# EAGLE design ECG-BioZ-Holter (EAGLE 6.5.0)

## Sheet 1 of 4
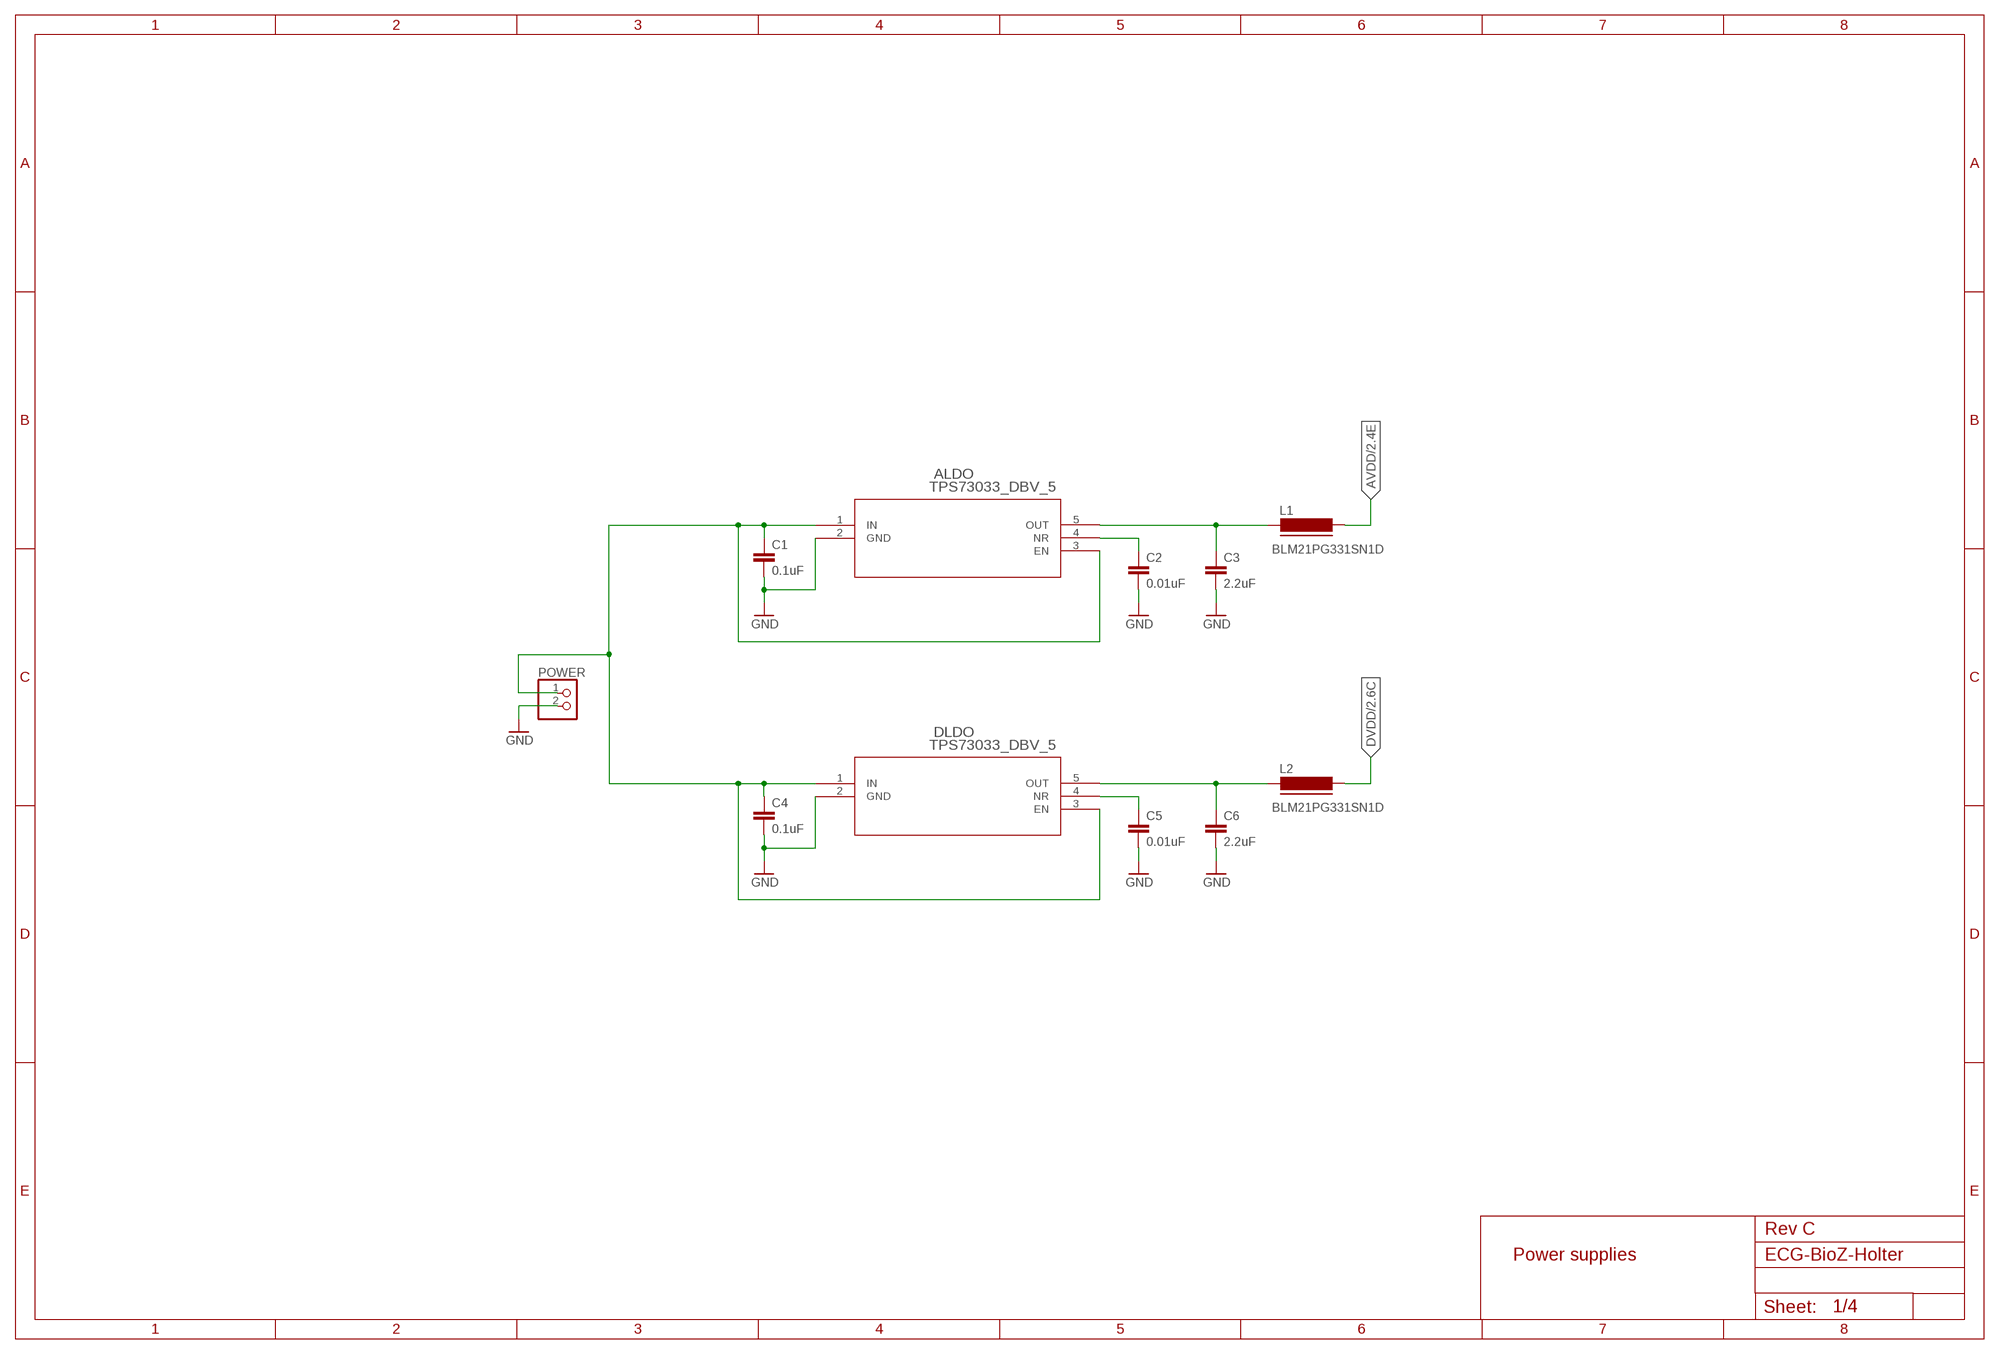
[diagram p0: schematic, sheet 1]

### Parts
ALDO  TPS73033_DBV_5  [DBV5]
C1  0.1uF  C-EUC0805  [C0805]
C2  0.01uF  C-EUC0805  [C0805]
C3  2.2uF  C-EUC0805  [C0805]
C4  0.1uF  C-EUC0805  [C0805]
C5  0.01uF  C-EUC0805  [C0805]
C6  2.2uF  C-EUC0805  [C0805]
DLDO  TPS73033_DBV_5  [DBV5]
L1  BLM21PG331SN1D  FERRITE-0805  [FB805]
L2  BLM21PG331SN1D  FERRITE-0805  [FB805]
POWER  PINHD-1X2  [1X02]

### Nets
AVDD: L1.2 ; also sheet 2
DVDD: L2.2 ; also sheet 2,3,4
GND: ALDO.2(GND) C1.2 C2.2 C3.2 C4.2 C5.2 C6.2 DLDO.2(GND) POWER.2 ; also sheet 2,3,4
N$2: ALDO.1(IN) ALDO.3(EN) C1.1 C4.1 DLDO.1(IN) DLDO.3(EN) POWER.1
N$5: C5.1 DLDO.4(NR)
N$6: ALDO.4(NR) C2.1
N$7: ALDO.5(OUT) C3.1 L1.1
N$8: C6.1 DLDO.5(OUT) L2.1

### Notes on the sheet
- Rev C
- Power supplies

## Sheet 2 of 4
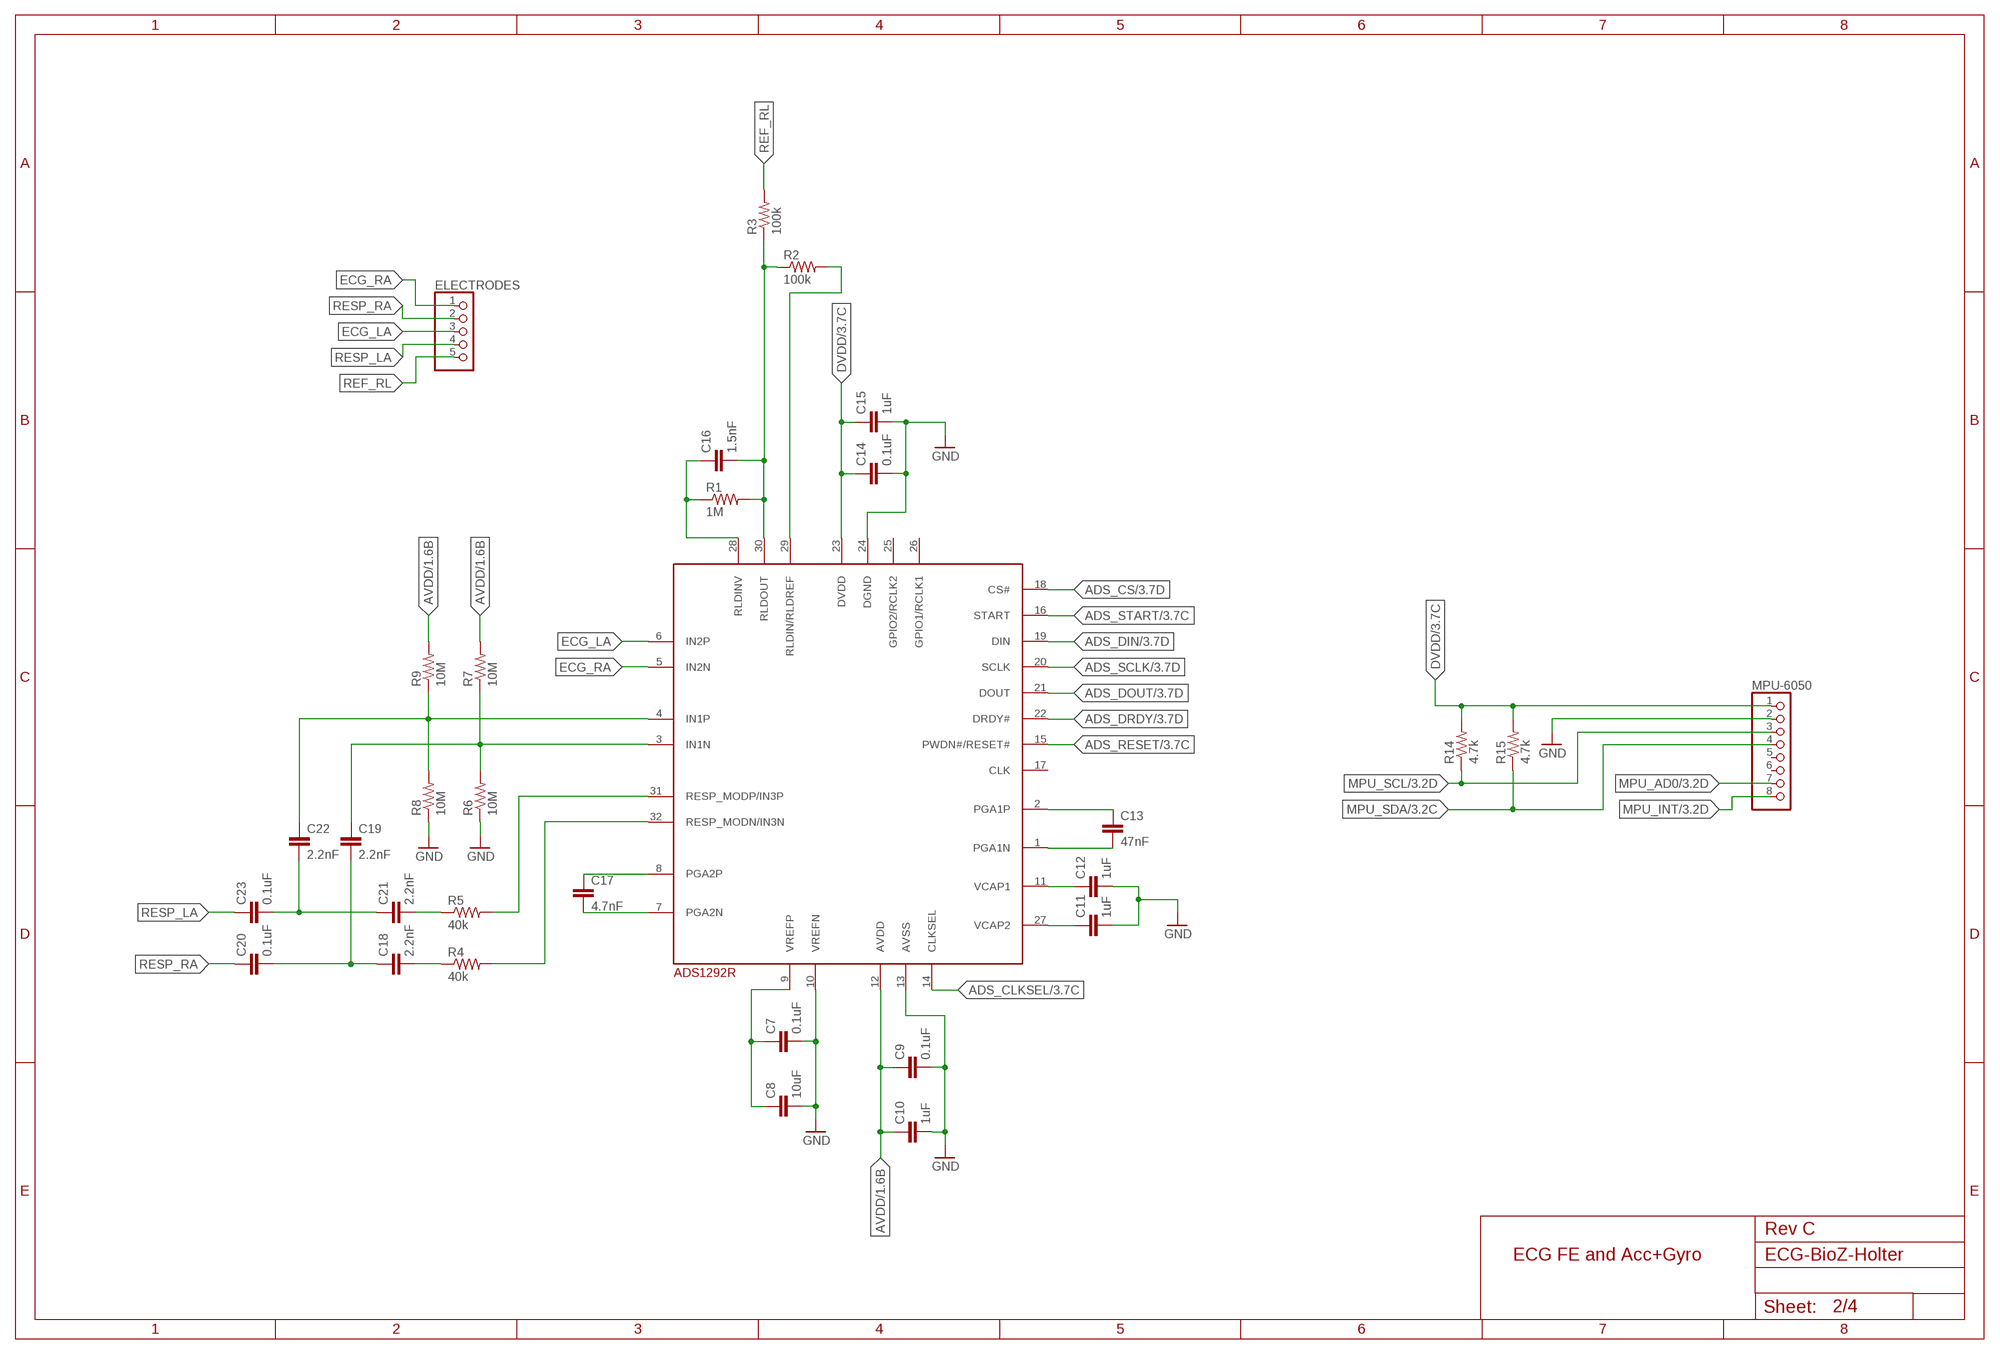
[diagram p1: schematic, sheet 2]

### Parts
ADS1292R  ADS1292R  [TQFP-32]
C7  0.1uF  C-EUC0805  [C0805]
C8  10uF  C-EUC0805  [C0805]
C9  0.1uF  C-EUC0805  [C0805]
C10  1uF  C-EUC0805  [C0805]
C11  1uF  C-EUC0805  [C0805]
C12  1uF  C-EUC0805  [C0805]
C13  47nF  C-EUC0805  [C0805]
C14  0.1uF  C-EUC0805  [C0805]
C15  1uF  C-EUC0805  [C0805]
C16  1.5nF  C-EUC0805  [C0805]
C17  4.7nF  C-EUC0805  [C0805]
C18  2.2nF  C-EUC0805  [C0805]
C19  2.2nF  C-EUC0805  [C0805]
C20  0.1uF  C-EUC0805  [C0805]
C21  2.2nF  C-EUC0805  [C0805]
C22  2.2nF  C-EUC0805  [C0805]
C23  0.1uF  C-EUC0805  [C0805]
ELECTRODES  PINHD-1X5  [1X05]
MPU  MPU-6050  PINHD-1X8  [1X08]
R1  1M  R-US_R0805  [R0805]
R2  100k  R-US_R0805  [R0805]
R3  100k  R-US_R0805  [R0805]
R4  40k  R-US_R0805  [R0805]
R5  40k  R-US_R0805  [R0805]
R6  10M  R-US_R0805  [R0805]
R7  10M  R-US_R0805  [R0805]
R8  10M  R-US_R0805  [R0805]
R9  10M  R-US_R0805  [R0805]
R14  4.7k  R-US_R0805  [R0805]
R15  4.7k  R-US_R0805  [R0805]

### Nets
ADS_CLKSEL: ADS1292R.14(CLKSEL) ; also sheet 3
ADS_CS: ADS1292R.18(CS#) ; also sheet 3
ADS_DIN: ADS1292R.19(DIN) ; also sheet 3
ADS_DOUT: ADS1292R.21(DOUT) ; also sheet 3
ADS_DRDY: ADS1292R.22(DRDY#) ; also sheet 3
ADS_RESET: ADS1292R.15(PWDN#/RESET#) ; also sheet 3
ADS_SCLK: ADS1292R.20(SCLK) ; also sheet 3
ADS_START: ADS1292R.16(START) ; also sheet 3
AVDD: ADS1292R.12(AVDD) C9.1 C10.1 R7.2 R9.2 ; also sheet 1
DVDD: ADS1292R.23(DVDD) C14.1 C15.1 MPU.1 R14.2 R15.2 ; also sheet 1,3,4
ECG_LA: ADS1292R.6(IN2P) ELECTRODES.3
ECG_RA: ADS1292R.5(IN2N) ELECTRODES.1
GND: ADS1292R.10(VREFN) ADS1292R.13(AVSS) ADS1292R.24(DGND) C7.2 C8.2 C9.2 C10.2 C11.2 C12.2 C14.2 C15.2 MPU.2 R6.1 R8.1 ; also sheet 1,3,4
MPU_AD0: MPU.7 ; also sheet 3
MPU_INT: MPU.8 ; also sheet 3
MPU_SCL: MPU.3 R14.1 ; also sheet 3
MPU_SDA: MPU.4 R15.1 ; also sheet 3
N$1: ADS1292R.11(VCAP1) C12.1
N$3: ADS1292R.9(VREFP) C7.1 C8.1
N$4: ADS1292R.27(VCAP2) C11.1
N$9: ADS1292R.2(PGA1P) C13.1
N$10: ADS1292R.1(PGA1N) C13.2
N$11: ADS1292R.30(RLDOUT) C16.2 R1.2 R2.1 R3.1
N$12: ADS1292R.28(RLDINV) C16.1 R1.1
N$13: ADS1292R.29(RLDIN/RLDREF) R2.2
N$14: ADS1292R.8(PGA2P) C17.1
N$15: ADS1292R.7(PGA2N) C17.2
N$16: ADS1292R.32(RESP_MODN/IN3N) R4.2
N$17: C18.2 R4.1
N$18: C18.1 C19.2 C20.2
N$19: ADS1292R.3(IN1N) C19.1 R6.2 R7.1
N$20: ADS1292R.31(RESP_MODP/IN3P) R5.2
N$21: C21.2 R5.1
N$22: C21.1 C22.2 C23.2
N$23: ADS1292R.4(IN1P) C22.1 R8.2 R9.1
REF_RL: ELECTRODES.5 R3.2
RESP_LA: C23.1 ELECTRODES.4
RESP_RA: C20.1 ELECTRODES.2
Unconnected: ADS1292R.17(CLK) ADS1292R.25(GPIO2/RCLK2) ADS1292R.26(GPIO1/RCLK1) MPU.5 MPU.6

### Notes on the sheet
- Rev C
- ECG FE and Acc+Gyro

## Sheet 3 of 4
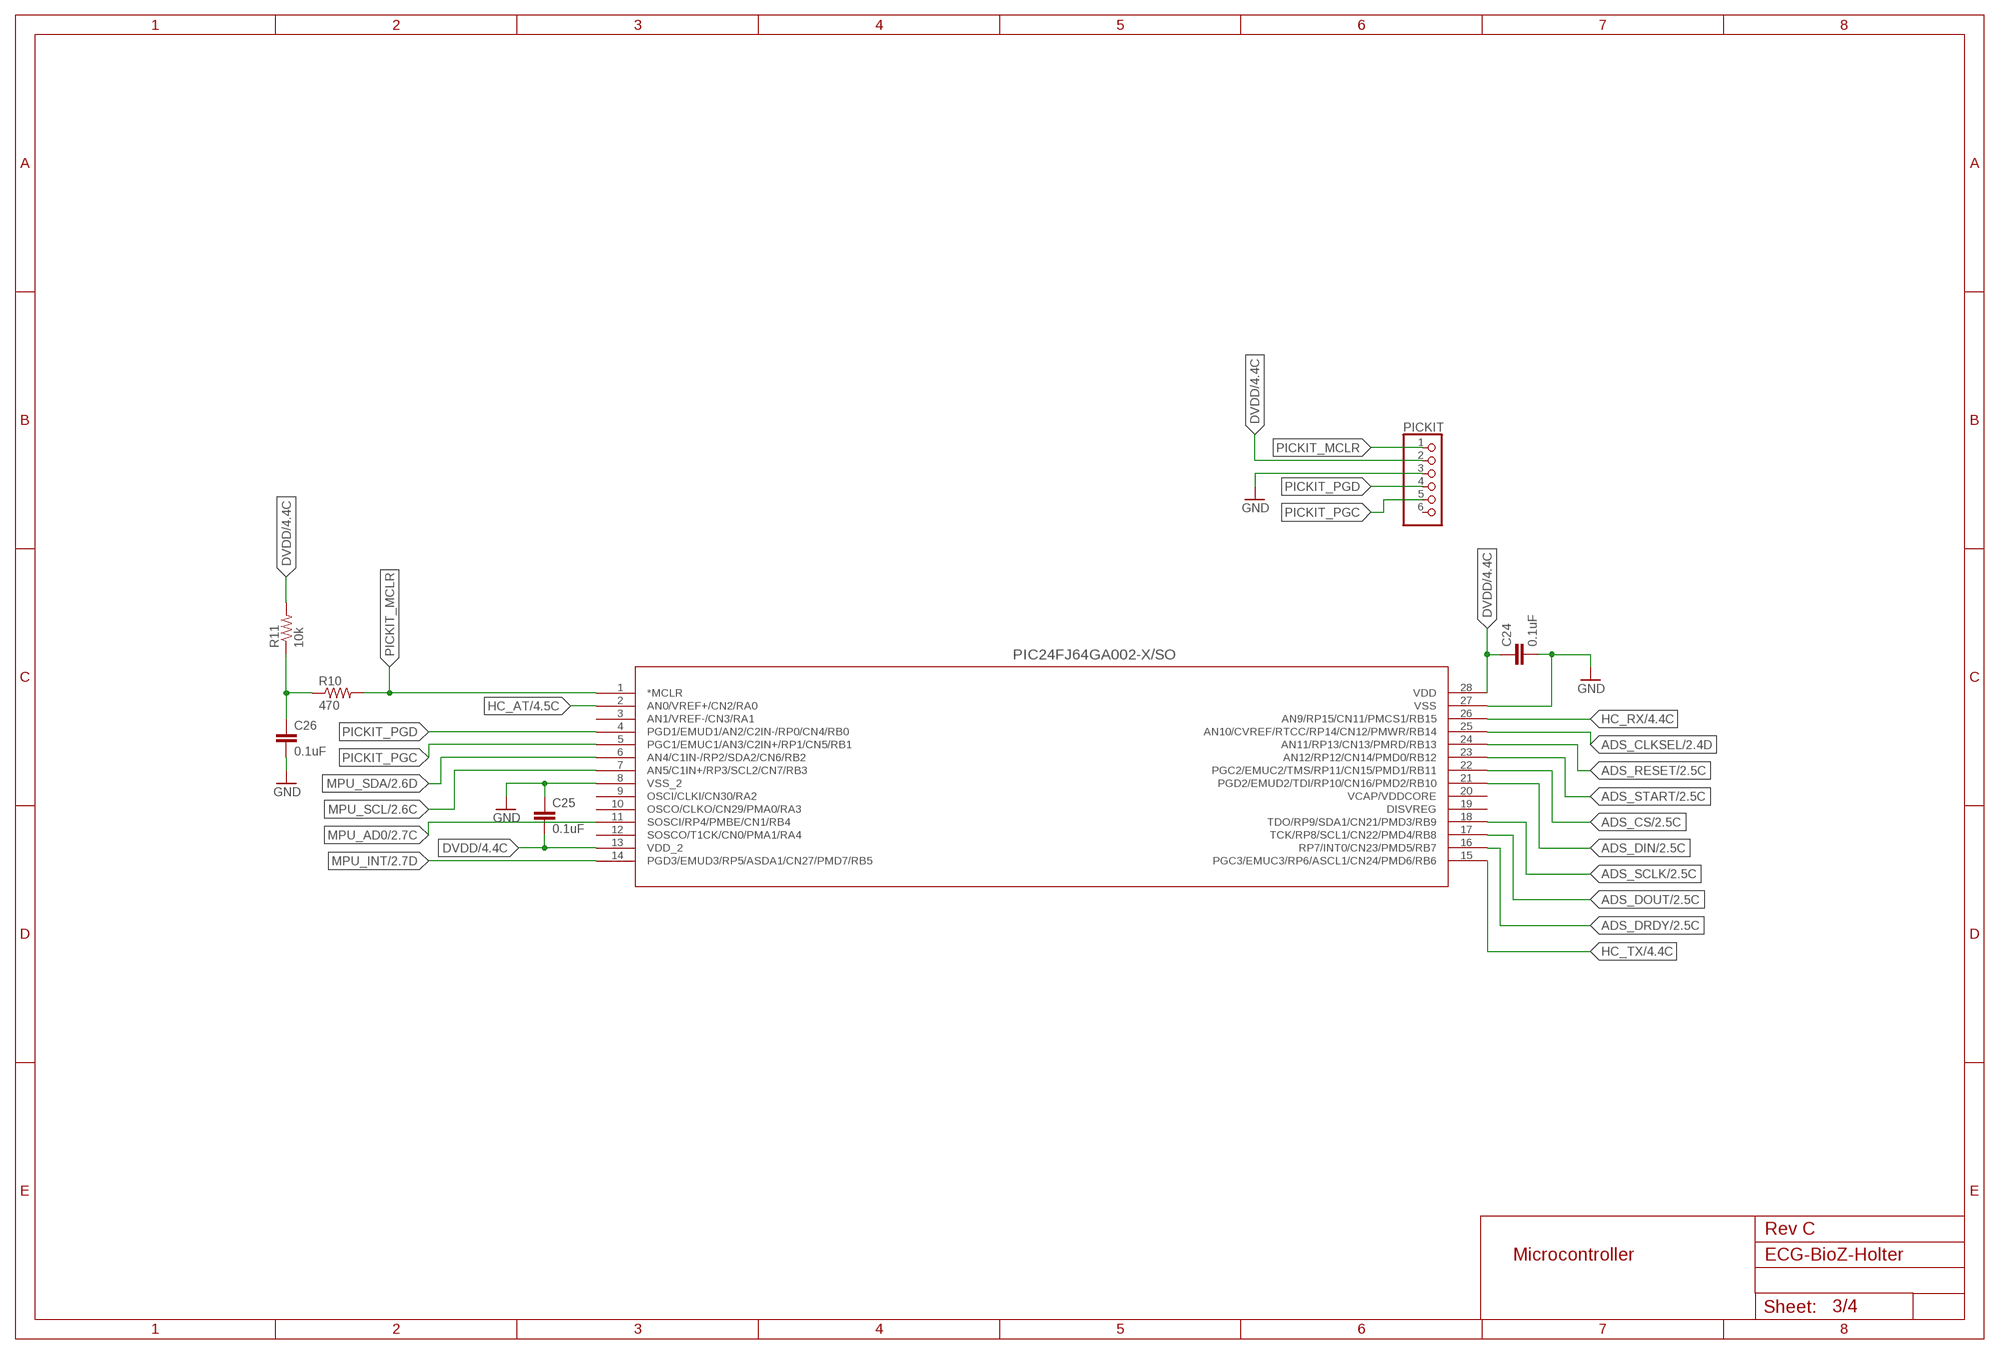
[diagram p2: schematic, sheet 3]

### Parts
C24  0.1uF  C-EUC0805  [C0805]
C25  0.1uF  C-EUC0805  [C0805]
C26  0.1uF  C-EUC0805  [C0805]
PIC24F  PIC24FJ64GA002-X/SO  [SOIC28-W_MC]
PICKIT  PINHD-1X6  [1X06]
R10  470  R-US_R0805  [R0805]
R11  10k  R-US_R0805  [R0805]

### Nets
ADS_CLKSEL: PIC24F.25(AN10/CVREF/RTCC/RP14/CN12/PMWR/RB14) ; also sheet 2
ADS_CS: PIC24F.22(PGC2/EMUC2/TMS/RP11/CN15/PMD1/RB11) ; also sheet 2
ADS_DIN: PIC24F.21(PGD2/EMUD2/TDI/RP10/CN16/PMD2/RB10) ; also sheet 2
ADS_DOUT: PIC24F.17(TCK/RP8/SCL1/CN22/PMD4/RB8) ; also sheet 2
ADS_DRDY: PIC24F.16(RP7/INT0/CN23/PMD5/RB7) ; also sheet 2
ADS_RESET: PIC24F.24(AN11/RP13/CN13/PMRD/RB13) ; also sheet 2
ADS_SCLK: PIC24F.18(TDO/RP9/SDA1/CN21/PMD3/RB9) ; also sheet 2
ADS_START: PIC24F.23(AN12/RP12/CN14/PMD0/RB12) ; also sheet 2
DVDD: C24.1 C25.2 PIC24F.13(VDD_2) PIC24F.28(VDD) PICKIT.2 R11.2 ; also sheet 1,2,4
GND: C24.2 C25.1 C26.2 PIC24F.8(VSS_2) PIC24F.27(VSS) PICKIT.3 ; also sheet 1,2,4
HC_AT: PIC24F.2(AN0/VREF+/CN2/RA0) ; also sheet 4
HC_RX: PIC24F.26(AN9/RP15/CN11/PMCS1/RB15) ; also sheet 4
HC_TX: PIC24F.15(PGC3/EMUC3/RP6/ASCL1/CN24/PMD6/RB6) ; also sheet 4
MPU_AD0: PIC24F.11(SOSCI/RP4/PMBE/CN1/RB4) ; also sheet 2
MPU_INT: PIC24F.14(PGD3/EMUD3/RP5/ASDA1/CN27/PMD7/RB5) ; also sheet 2
MPU_SCL: PIC24F.7(AN5/C1IN+/RP3/SCL2/CN7/RB3) ; also sheet 2
MPU_SDA: PIC24F.6(AN4/C1IN-/RP2/SDA2/CN6/RB2) ; also sheet 2
N$25: C26.1 R10.1 R11.1
PICKIT_MCLR: PIC24F.1(*MCLR) PICKIT.1 R10.2
PICKIT_PGC: PIC24F.5(PGC1/EMUC1/AN3/C2IN+/RP1/CN5/RB1) PICKIT.5
PICKIT_PGD: PIC24F.4(PGD1/EMUD1/AN2/C2IN-/RP0/CN4/RB0) PICKIT.4
Unconnected: PIC24F.3(AN1/VREF-/CN3/RA1) PIC24F.9(OSCI/CLKI/CN30/RA2) PIC24F.10(OSCO/CLKO/CN29/PMA0/RA3) PIC24F.12(SOSCO/T1CK/CN0/PMA1/RA4) PIC24F.19(DISVREG) PIC24F.20(VCAP/VDDCORE) PICKIT.6

### Notes on the sheet
- Rev C
- Microcontroller

## Sheet 4 of 4
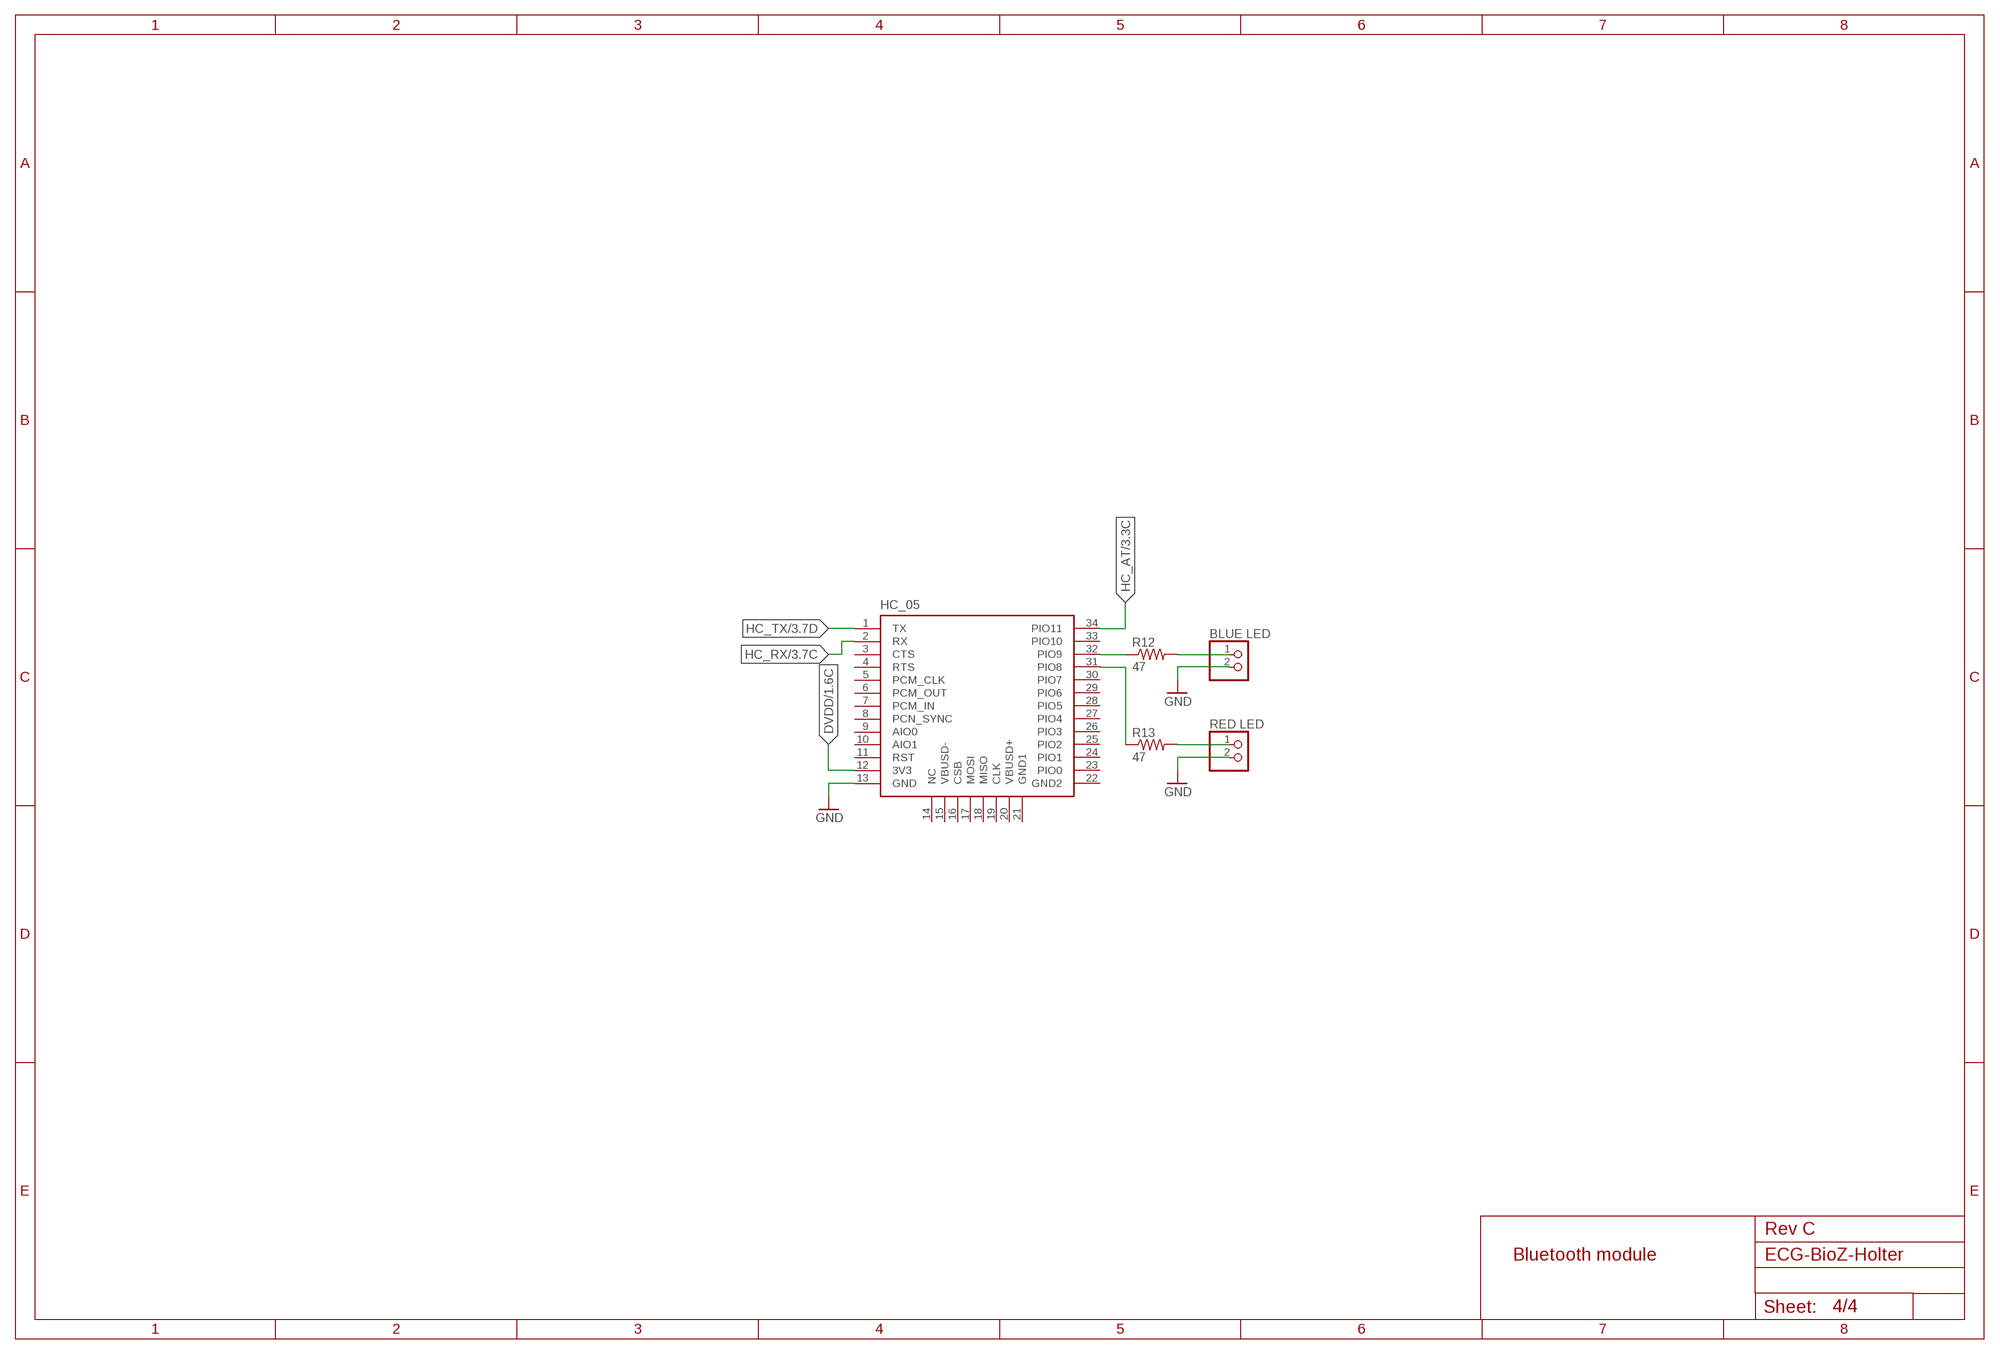
[diagram p3: schematic, sheet 4]

### Parts
BLUE  BLUE LED  PINHD-1X2  [1X02]
HC_05  HC_05  [BLUETOOTH_SMD]
R12  47  R-US_R0805  [R0805]
R13  47  R-US_R0805  [R0805]
RED  RED LED  PINHD-1X2  [1X02]

### Nets
DVDD: HC_05.12(3V3) ; also sheet 1,2,3
GND: BLUE.2 HC_05.13(GND) RED.2 ; also sheet 1,2,3
HC_AT: HC_05.34(PIO11) ; also sheet 3
HC_RX: HC_05.2(RX) ; also sheet 3
HC_TX: HC_05.1(TX) ; also sheet 3
N$24: HC_05.32(PIO9) R12.1
N$26: BLUE.1 R12.2
N$27: HC_05.31(PIO8) R13.1
N$28: R13.2 RED.1
Unconnected: HC_05.3(CTS) HC_05.4(RTS) HC_05.5(PCM_CLK) HC_05.6(PCM_OUT) HC_05.7(PCM_IN) HC_05.8(PCN_SYNC) HC_05.9(AIO0) HC_05.10(AIO1) HC_05.11(RST) HC_05.14(NC) HC_05.15(VBUSD-) HC_05.16(CSB) HC_05.17(MOSI) HC_05.18(MISO) HC_05.19(CLK) HC_05.20(VBUSD+) HC_05.21(GND1) HC_05.22(GND2) HC_05.23(PIO0) HC_05.24(PIO1) HC_05.25(PIO2) HC_05.26(PIO3) HC_05.27(PIO4) HC_05.28(PIO5) HC_05.29(PIO6) HC_05.30(PIO7) HC_05.33(PIO10)

### Notes on the sheet
- Rev C
- Bluetooth module

## Library data of the parts
ADS1292R = holter:ADS1292R
ALDO DLDO = holter:TPS73033_DBV_5; DATASHEETURL: http://www.ti.com/lit/gpn/TPS73033; DESCRIPTION: Single Output LDO, 200mA, Fixed(3.3V), High PSRR, Low Noise; FAMILY_NAME: SINGLE CHANNEL LDO; GENERIC_PART_NUMBER: TPS73033; INDUSTRY_STD_PKG_TYPE: SOT-23; MANUFACTURER: Texas Instruments; MANUFACTURER_PART_NUMBER: tps73033_dbv_5; PACKAGE_DESIGNATOR: DBV; PIN_COUNT: 5; VENDOR: Texas Instruments
BLUE POWER RED = pinhead:PINHD-1X2: PIN HEADER
C1-C26 = rcl:C-EU: CAPACITOR, European symbol
ELECTRODES = pinhead:PINHD-1X5: PIN HEADER
HC_05 = holter:HC_05: HC-05 Bluetooth Module
L1 L2 = holter:FERRITE: Ferrite bead in various packages
MPU = pinhead:PINHD-1X8: PIN HEADER
PIC24F = holter:PIC24FJ64GA002-X/SO
PICKIT = pinhead:PINHD-1X6: PIN HEADER
R1-R15 = rcl:R-US_: RESISTOR, American symbol

## Net classes
0 default: width 0.254 mm

## Board
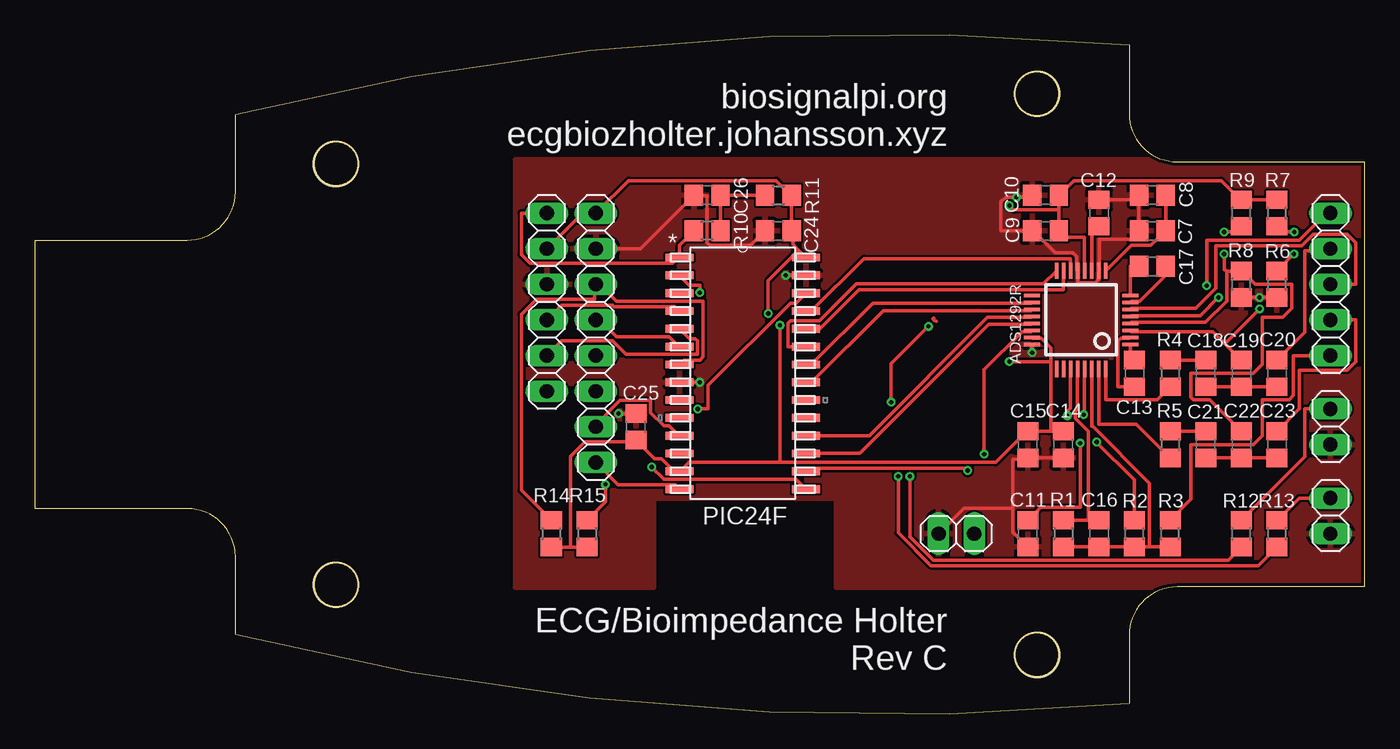
[diagram p4: board, top side]
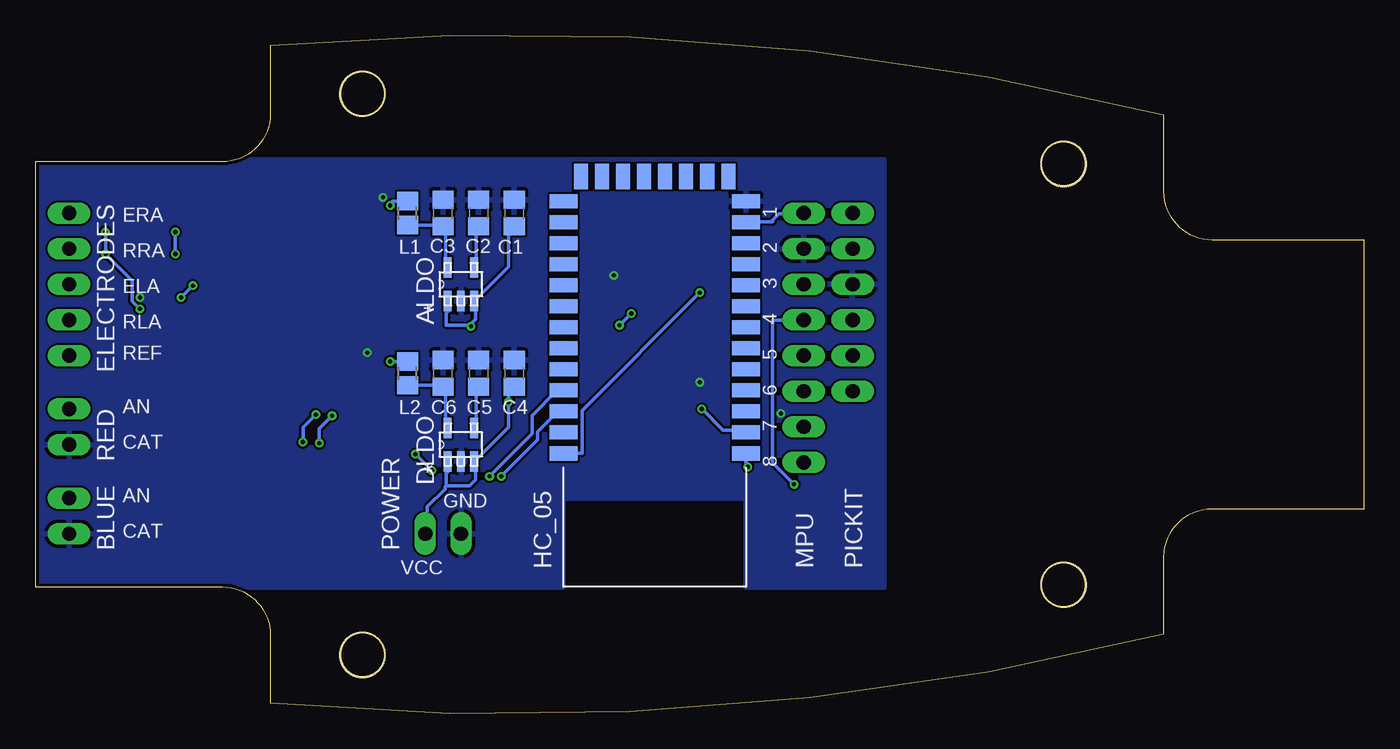
[diagram p5: board, bottom side, seen from below]

Size 94.81 x 48.37 mm. Coordinates in mm from the lower left corner, seen from the top.
Outline: 78.03,0.74 78.03,5.61 arc-90 81.46,9.04 94.81,9.04 94.81,24.19 94.81,39.34 81.46,39.34 arc-90 78.03,42.77 78.03,47.63 arc19 14.29,42.71 14.29,37.19 arc-90 10.86,33.76 0,33.76 0,24.19 0,14.62 10.86,14.62 arc-90 14.29,11.19 14.29,5.66 arc19 78.03,0.74
Outline: 78.03,0.74 78.03,0.74
Outline: circle at 71.46,4.19 radius 1.55
Outline: circle at 21.46,9.19 radius 1.55
Outline: circle at 21.46,39.19 radius 1.55
Outline: circle at 71.46,44.19 radius 1.55
Copper layers (1*16): Top 0.035mm / dielectric 1.5mm / Bottom 0.035mm
Design rules "ITEADstudio_DRC": minimum track width 6mil, minimum drill 12mil, track to track 6mil, track to pad 6mil, pad to pad 6mil, via to via 6mil, smd to smd 0mil, copper to edge 10mil, drill to drill 10mil, minimum pad ring 10mil, minimum via ring 6mil, stop-mask expansion 2mil, vias tented up to drill 100mil, thermal gap 10mil
Holes 3.2 mm at 21.46,39.19 21.46,9.19 71.46,4.19 71.46,44.19

### Footprints (pad centres in the part's own frame; a part is rotated, then mirrored left to right if it is on the bottom)
TQFP-32 = smd 1.143 x 0.254: 1 -3.5,1.75; 2 -3.5,1.25; 3 -3.5,0.75; 4 -3.5,0.25; 5 -3.5,-0.25; 6 -3.5,-0.75; 7 -3.5,-1.25; 8 -3.5,-1.75; 17 3.5,-1.75; 18 3.5,-1.25; 19 3.5,-0.75; 20 3.5,-0.25; 21 3.5,0.25; 22 3.5,0.75; 23 3.5,1.25; 24 3.5,1.75 | smd 0.254 x 1.143: 9 -1.75,-3.5; 10 -1.25,-3.5; 11 -0.75,-3.5; 12 -0.25,-3.5; 13 0.25,-3.5; 14 0.75,-3.5; 15 1.25,-3.5; 16 1.75,-3.5; 25 1.75,3.5; 26 1.25,3.5; 27 0.75,3.5; 28 0.25,3.5; 29 -0.25,3.5; 30 -0.75,3.5; 31 -1.25,3.5; 32 -1.75,3.5
DBV5 = smd 1.473 x 0.559: 1 -1.194,0.95; 2 -1.194,0; 3 -1.194,-0.95; 4 1.194,-0.95; 5 1.194,0.95
1X02 = drill 1.016 long: 1 -1.27,0; 2 1.27,0
C0805 = smd 1.3 x 1.5: 1 -0.95,0; 2 0.95,0
1X05 = drill 1.016 long: 1 -5.08,0; 2 -2.54,0; 3 0,0; 4 2.54,0; 5 5.08,0
BLUETOOTH_SMD = smd 2 x 1: 1 -6.35,3.81; 2 -6.35,2.31; 3 -6.35,0.81; 4 -6.35,-0.69; 5 -6.35,-2.19; 6 -6.35,-3.69; 7 -6.35,-5.19; 8 -6.35,-6.69; 9 -6.35,-8.19; 10 -6.35,-9.69; 11 -6.35,-11.19; 12 -6.35,-12.69; 13 -6.35,-14.19; 22 6.65,-14.19; 23 6.65,-12.69; 24 6.65,-11.19; 25 6.65,-9.69; 26 6.65,-8.19; 27 6.65,-6.69; 28 6.65,-5.19; 29 6.65,-3.69; 30 6.65,-2.19; 31 6.65,-0.69; 32 6.65,0.81; 33 6.65,2.31; 34 6.65,3.81 | smd 1 x 1.8: 14 -5.1,-15.94; 15 -3.6,-15.94; 16 -2.1,-15.94; 17 -0.6,-15.94; 18 0.9,-15.94; 19 2.4,-15.94; 20 3.9,-15.94; 21 5.4,-15.94
FB805 = smd 1.3 x 1.5: 1 -0.85,0; 2 0.85,0
1X08 = drill 1.016 long: 1 -8.89,0; 2 -6.35,0; 3 -3.81,0; 4 -1.27,0; 5 1.27,0; 6 3.81,0; 7 6.35,0; 8 8.89,0
SOIC28-W_MC = smd 1.981 x 0.559: 1 -4.515,8.255; 2 -4.515,6.985; 3 -4.515,5.715; 4 -4.515,4.445; 5 -4.515,3.175; 6 -4.515,1.905; 7 -4.515,0.635; 8 -4.515,-0.635; 9 -4.515,-1.905; 10 -4.515,-3.175; 11 -4.515,-4.445; 12 -4.515,-5.715; 13 -4.515,-6.985; 14 -4.515,-8.255; 15 4.515,-8.255; 16 4.515,-6.985; 17 4.515,-5.715; 18 4.515,-4.445; 19 4.515,-3.175; 20 4.515,-1.905; 21 4.515,-0.635; 22 4.515,0.635; 23 4.515,1.905; 24 4.515,3.175; 25 4.515,4.445; 26 4.515,5.715; 27 4.515,6.985; 28 4.515,8.255
1X06 = drill 1.016 long: 1 -6.35,0; 2 -3.81,0; 3 -1.27,0; 4 1.27,0; 5 3.81,0; 6 6.35,0
R0805 = smd 1.3 x 1.5: 1 -0.95,0; 2 0.95,0

### Placement (x,y rotation side)
ADS1292R  74.6,28.07 180 top
ALDO  64.44,30.61 90 bottom
BLUE  92.38,14.1 270 top
C1  60.63,35.69 90 bottom
C2  63.17,35.69 90 bottom
C3  65.71,35.69 90 bottom
C4  60.63,24.26 90 bottom
C5  63.17,24.26 90 bottom
C6  65.71,24.26 90 bottom
C7  79.68,34.42 180 top
C8  79.68,36.96 180 top
C9  72.06,34.42 180 top
C10  72.06,36.96 180 top
C11  70.79,12.83 270 top
C12  75.87,35.69 90 top
C13  78.41,24.26 90 top
C14  73.33,19.18 270 top
C15  70.79,19.18 270 top
C16  75.87,12.83 270 top
C17  79.68,31.88 0 top
C18  83.49,24.26 90 top
C19  86.03,24.26 270 top
C20  88.57,24.26 270 top
C21  83.49,19.18 90 top
C22  86.03,19.18 270 top
C23  88.57,19.18 270 top
C24  53.01,34.42 180 top
C25  42.85,20.45 270 top
C26  47.93,36.96 180 top
DLDO  64.44,19.18 90 bottom
ELECTRODES  92.38,30.61 270 top
HC_05  50.47,22.35 180 bottom
L1  68.25,35.69 90 bottom
L2  68.25,24.26 90 bottom
MPU  39.99,26.8 270 top
PIC24F  50.47,24.26 0 top
PICKIT  36.5,29.34 270 top
POWER  65.71,12.83 180 top
R1  73.33,12.83 270 top
R2  78.41,12.83 90 top
R3  80.95,12.83 90 top
R4  80.95,24.26 270 top
R5  80.95,19.18 270 top
R6  88.57,30.61 90 top
R7  88.57,35.69 90 top
R8  86.03,30.61 90 top
R9  86.03,35.69 90 top
R10  47.93,34.42 180 top
R11  53.01,36.96 0 top
R12  88.57,12.83 90 top
R13  86.03,12.83 90 top
R14  36.82,12.83 270 top
R15  39.36,12.83 270 top
RED  92.38,20.45 270 top

### Tracks (layer width: path | path; a pad name or v marks a point on that pad's centre or on a via)
ADS_CLKSEL
  Top 0.254: PIC24F.25 55.39,28.7 59.12,32.44 73.83,32.44 73.83,31.57 ADS1292R.14
ADS_CS
  Top 0.254: PIC24F.22 55.39,24.89 59.75,29.26 71.03,29.26 71.08,29.31 ADS1292R.18
ADS_DIN
  Top 0.254: PIC24F.21 55.39,23.62 60.49,28.73 71.01,28.73 71.08,28.8 ADS1292R.19
ADS_DOUT
  Top 0.254: PIC24F.17 58.81,18.54 68.04,27.76 71.03,27.76 71.08,27.81 ADS1292R.21
ADS_DRDY  (via drill 0.3)
  Top 0.254: v67.68,18.49 67.68,24.51 70.4,27.23 71.01,27.23 71.08,27.3 ADS1292R.22 | v66.51,17.32 66.33,17.5 55.23,17.5 55,17.27 PIC24F.16
  Bottom 0.254: v66.51,17.32 v67.68,18.49
ADS_RESET
  Top 0.254: PIC24F.24 55.97,27.43 58.76,30.23 73.34,30.23 73.34,31.55 ADS1292R.15
ADS_SCLK
  Top 0.254: PIC24F.18 59.5,19.81 67.93,28.24 71.03,28.24 71.08,28.3 ADS1292R.20
ADS_START
  Top 0.254: PIC24F.23 53.71,26.16 53.71,27.84 53.86,27.99 55.94,27.99 58.59,30.63 71.92,30.63 72.84,31.55 ADS1292R.16
AVDD  (via drill 0.3)
  Top 0.254: R7.2 86.04,36.63 R9.2 85.92,36.68 84.6,38 74.08,38 73.12,37.03 C10.1 73.01,35.92 | ADS1292R.12 74.84,33.96 73.47,33.96 C9.1 73.01,34.52 73.01,35.92 | v69.48,36.22 69.79,35.92 73.01,35.92
  Bottom 0.254: v69.48,36.22 69.48,36.25 69.36,36.37 69.36,36.53 68.26,36.53 L1.2
DVDD  (via drill 0.3)
  Top 0.254: 54.46,33.03 54.04,33.45 54.04,34.32 C24.1 R11.2 53.84,37.01 52.85,38 42.33,38 40.1,35.76 MPU.1 39.05,35.69 36.51,33.15 PICKIT.2 | 54.46,33.03 PIC24F.28 | 72.43,20.14 72.43,25.1 | 72.43,25.1 72.43,26.09 71.77,26.75 71.16,26.75 71.11,26.8 ADS1292R.23 | 72.43,20.14 73.32,20.14 C14.1 | 72.43,25.1 v69.48,25.1 | 72.43,20.14 72.33,20.12 70.8,20.12 C15.1 70.68,20.07 68.52,17.91 53.13,17.91 | 53.13,17.91 46.65,17.91 46.06,17.32 PIC24F.13 45.56,17.27 44.67,18.16 44.18,18.16 42.86,19.48 C25.2 42.74,19.44 42.74,19.39 39.23,19.39 38.19,18.35 38.19,11.87 | 54.46,33.03 52.29,30.86 v52.29,28.52 | 53.13,17.91 v53.13,27.69 | 38.19,11.87 R15.2 | 38.19,11.87 R14.2
  Bottom 0.254: MPU.1 39.99,35.64 41.75,35.64 42.2,35.18 42.2,35.05 HC_05.12 | v69.48,25.1 68.26,25.1 L2.2 | v53.13,27.69 v52.29,28.52
ECG_LA
  Top 0.254: ELECTRODES.3 94.2,30.61 94.2,33.58 93.59,34.19 91.17,34.19 90.34,33.35 84.21,33.35 84.21,30.33 82.79,28.91 78.2,28.91 78.12,28.83 ADS1292R.6
ECG_RA  (via drill 0.3)
  Top 0.254: v84.39,29.67 83.1,28.37 78.17,28.37 78.12,28.32 ADS1292R.5 | v83.55,30.51 83.55,33.76 90.16,33.76 92.09,35.69 ELECTRODES.1
  Bottom 0.254: v83.55,30.51 v84.39,29.67
GND  (via drill 0.3)
  Top 0.254: C10.2 70.96,36.8 v69.99,36.8 69.23,36.8 68.9,36.47 68.9,34.42 C9.2 71.24,34.37 72.76,32.84 74,32.84 74.28,32.56 74.28,31.67 ADS1292R.13 74.36,31.55 74.36,30.71 75.6,30.71 75.83,30.94 75.83,31.55 ADS1292R.10 75.91,31.67 75.91,33.81 78.09,33.81 78.63,34.34 C7.2 C8.2 78.63,36.63 75.88,36.63 C12.2 | C14.2 73.32,18.24 70.8,18.24 C15.2 70.7,18.14 69.74,18.14 69.74,14.63 | 69.74,14.63 69.74,12.93 70.78,11.89 C11.2 | R8.1 86.04,29.67 v87.31,29.67 88.56,29.67 R6.1 | v71.11,25.73 ADS1292R.24 | v41.62,21.39 C25.1 | MPU.2 43.17,33.15 C26.2 47.11,36.91 47.92,36.91 47.92,33.58 48.12,33.38 51.02,33.38 C24.2 | v47.41,23.62 PIC24F.8 | v53.53,31.24 PIC24F.27 | 69.74,14.63 66.26,14.63 64.45,12.83 POWER.2
  pour Bottom: 34.28,39.5 34.28,9.02 44.12,9.02 44.12,15.37 57.14,15.37 57.14,9.02 94.6,9.02 94.6,39.5
  pour Top: 57.14,9.02 57.14,15.37 44.12,15.37 44.12,9.02 34.28,9.02 34.28,39.5 94.6,39.5 94.6,9.02
HC_AT  (via drill 0.3)
  Top 0.254: v47.41,30.01 47.41,30.54 46.65,30.54 45.96,31.23 PIC24F.2
  Bottom 0.254: v47.41,30.01 55.82,21.6 55.82,18.55 HC_05.34
HC_RX  (via drill 0.3)
  Top 0.254: v47.26,21.72 47.99,21.72 47.99,23.39 53.86,29.26 54.27,29.26 PIC24F.26
  Bottom 0.254: v47.26,21.72 45.73,20.19 44.13,20.19 44.13,20.07 HC_05.2
HC_TX  (via drill 0.3)
  Top 0.254: v43.98,17.58 44.84,16.71 54.27,16.71 PIC24F.15
  Bottom 0.254: v43.98,17.58 44.11,17.7 HC_05.1
MPU_AD0
  Top 0.254: MPU.7 39.99,20.6 41.72,22.33 43.91,22.33 43.91,21.46 44.84,20.52 45.23,20.52 45.94,19.81 PIC24F.11
MPU_INT
  Top 0.254: MPU.8 41.59,16.31 45.63,16.31 45.94,16 PIC24F.14
MPU_SCL
  Top 0.254: PIC24F.7 46.27,25.2 47.41,25.2 47.64,25.43 47.64,29.41 41.47,29.41 40.27,30.61 MPU.3 39.89,30.54 39.89,29.55 35.75,29.55 34.68,28.49 34.68,15.91 R14.1
MPU_SDA  (via drill 0.3)
  Top 0.254: MPU.4 40.27,28.07 41.47,26.87 45.23,26.87 45.94,26.16 PIC24F.6 | v40.68,16.34 40.68,15.1 R15.1
  Bottom 0.254: v40.68,16.34 42.2,17.87 42.2,28.05 MPU.4
N$1
  Top 0.254: ADS1292R.11 75.38,31.57 75.38,34.72 75.86,34.72 C12.1
N$2  (via drill 0.3)
  Top 0.254: v63.72,27.61 61.05,24.94 v61.05,22.2
  Bottom 0.254: 63.81,27.7 63.82,27.69 65.5,27.69 65.5,28.55 65.39,28.65 ALDO.1 | 63.81,27.7 63.39,28.12 63.39,29.31 ALDO.3 63.39,29.49 61.02,31.85 61.02,34.34 60.64,34.72 C1.1 | 65.5,16.26 63.82,16.26 63.39,16.69 63.39,17.88 DLDO.3 63.39,18.06 61.02,20.42 61.02,22.2 | 65.5,16.26 65.5,17.12 65.39,17.22 DLDO.1 | 61.02,22.2 61.02,22.91 60.64,23.29 C4.1 | POWER.1 66.84,12.95 66.84,14.73 65.57,16 65.57,16.15 65.5,16.26 | v63.72,27.61 63.81,27.7 | v61.05,22.2 61.02,22.2
N$3
  Top 0.254: ADS1292R.9 76.37,31.57 78.17,33.38 79.57,33.38 80.61,34.42 C7.1 80.63,34.52 C8.1
N$4  (via drill 0.3)
  Top 0.254: v73.62,21.23 73.62,21.56 73.83,21.77 73.83,24.56 ADS1292R.27 | v74.54,19.28 74.54,14.71 71.72,14.71 70.8,13.79 C11.1
  Bottom 0.254: v73.62,21.23 74.54,20.32 v74.54,19.28
N$5
  Bottom 0.254: DLDO.4 63.36,20.5 63.36,23.11 63.18,23.29 C5.1
N$6
  Bottom 0.254: ALDO.4 63.36,31.93 63.36,34.54 63.18,34.72 C2.1
N$7
  Bottom 0.254: ALDO.5 65.52,31.93 65.52,34.54 65.7,34.72 C3.1 65.83,34.8 65.83,34.82 L1.1
N$8
  Bottom 0.254: DLDO.5 65.52,20.5 65.52,23.11 65.7,23.29 C6.1 65.83,23.37 65.83,23.39 68.24,23.39 L2.1
N$9
  Top 0.254: ADS1292R.2 78.09,26.8 78.04,26.75 77.43,26.75 77.23,26.54 77.23,23.32 78.4,23.32 C13.1
N$10
  Top 0.254: ADS1292R.1 78.12,26.31 78.12,25.22 78.4,25.22 C13.2
N$11
  Top 0.254: R1.2 73.34,11.89 75.86,11.89 C16.2 75.99,11.89 78.3,11.89 R2.1 78.42,11.89 79.47,11.89 | 79.47,11.89 79.47,16.43 75.43,20.47 75.38,20.47 75.38,24.56 ADS1292R.30 | 79.47,11.89 80.94,11.89 R3.1
N$12
  Top 0.254: 75.12,13.79 75.12,20.14 74.21,21.06 74.21,21.56 74.33,21.69 74.33,24.56 ADS1292R.28 | 75.12,13.79 75.86,13.79 C16.1 | R1.1 73.34,13.77 75.02,13.77 75.12,13.79
N$13  (via drill 0.3)
  Top 0.254: v74.79,21.31 74.84,21.31 ADS1292R.29 | v75.71,19.35 78.4,16.66 78.4,13.79 R2.2
  Bottom 0.254: v74.79,21.31 75.71,20.4 v75.71,19.35
N$14
  Top 0.254: C17.1 78.12,31.88 78.12,29.82 ADS1292R.8
N$15
  Top 0.254: ADS1292R.7 78.12,29.34 78.17,29.39 78.78,29.39 80.61,31.22 80.61,31.88 C17.2
N$16
  Top 0.254: ADS1292R.32 76.37,24.56 76.37,22.38 80.02,22.38 80.94,23.29 R4.2
N$17
  Top 0.254: R4.1 80.96,25.2 C18.2
N$18
  Top 0.254: C18.1 83.5,23.32 86.02,23.32 C19.2 86.15,23.32 88.56,23.32 C20.2
N$19  (via drill 0.3)
  Top 0.254: v89.8,34.34 88.96,34.34 88.58,34.72 R7.1 | v89.78,32.77 88.58,31.57 R6.2 | 84.86,26.38 86.02,25.22 C19.1 | 84.86,26.38 84.01,27.23 78.2,27.23 78.12,27.3 ADS1292R.3 | 84.86,26.38 v87.34,28.85
  Bottom 0.254: v89.8,34.34 89.78,34.32 v89.78,32.77 89.7,32.66 87.9,30.86 87.9,29.41 v87.34,28.85
N$20
  Top 0.254: ADS1292R.31 75.86,20.62 78.55,20.62 80.94,18.24 R5.2
N$21
  Top 0.254: R5.1 80.96,20.12 C21.2
N$22
  Top 0.254: C21.1 83.5,18.24 86.02,18.24 C22.2 86.15,18.24 88.56,18.24 C23.2
N$23  (via drill 0.3)
  Top 0.254: 84.98,31.55 84.98,29.41 83.45,27.89 78.17,27.89 78.12,27.84 ADS1292R.4 | 84.98,31.55 R8.2 86.15,31.5 87.03,30.61 89.63,30.61 89.63,28.91 88.99,28.27 87.52,28.27 87.52,24.89 86.88,24.26 82.44,24.26 82.44,22.56 82.61,22.38 83.78,22.38 86.02,20.14 C22.1 | v84.8,34.34 85.64,34.34 86.02,34.72 R9.1 | v84.8,32.77 84.8,31.65 84.9,31.65 84.98,31.55
  Bottom 0.254: v84.8,32.77 v84.8,34.34
N$24  (via drill 0.3)
  Top 0.254: v61.56,16.92 61.56,12.88 63.89,10.54 87.24,10.54 88.56,11.86 R12.1
  Bottom 0.254: v61.56,16.92 58.97,19.51 58.97,20.09 57.52,21.54 57.14,21.54 HC_05.32
N$25
  Top 0.254: R10.1 C26.1 R11.1
N$26
  Top 0.254: BLUE.1 90.16,15.37 88.58,13.79 R12.2
N$27  (via drill 0.3)
  Top 0.254: v62.4,16.92 62.4,12.62 64.07,10.95 85.1,10.95 86.02,11.86 R13.1
  Bottom 0.254: v62.4,16.92 59.37,19.94 59.37,21.23 57.57,23.04 57.14,23.04 HC_05.31
N$28
  Top 0.254: RED.1 90.56,21.72 90.56,18.31 86.04,13.79 R13.2
N$29
  Top 0.254: 64.05,28.16 64.08,28.17 | 64.08,28.17 64.09,28.17 | 64.07,28.11 64.1,28.13 | 64.1,28.13 64.11,28.14 | 64.11,28.14 64.11,28.15 | 64.28,27.98 64.12,28.05 64.1,28.13 | 64.08,28.17 64.07,28.18 64.11,28.14 | 64.1,28.13
PICKIT_MCLR
  Top 0.254: R10.2 45.96,33.4 PIC24F.1 45.84,32.46 45.48,32.11 35.29,32.11 34.68,32.72 34.68,35.69 PICKIT.1
PICKIT_PGC
  Top 0.254: PIC24F.5 46.67,26.72 47.08,26.72 47.23,26.57 47.23,25.6 42.15,25.6 41.19,26.57 37.56,26.57 36.51,25.53 PICKIT.5
PICKIT_PGD
  Top 0.254: PIC24F.4 45.94,28.7 45.63,29.01 41.29,29.01 41.19,29.11 37.56,29.11 36.51,28.07 PICKIT.4
REF_RL
  Top 0.254: ELECTRODES.5 89.75,25.53 89.75,22.68 89.45,22.38 87.52,22.38 87.52,19.81 86.88,19.18 82.44,19.18 82.44,15.27 80.96,13.79 R3.2
RESP_LA
  Top 0.254: ELECTRODES.4 94.2,28.07 94.2,25.1 93.59,24.49 90.16,24.49 90.16,21.72 88.58,20.14 C23.1
RESP_RA
  Top 0.254: C20.1 88.58,25.22 90.56,27.2 90.56,32.99 92.22,32.99 ELECTRODES.2

### Text on the board
tPlace: biosignalpi.org / ecgbiozholter.johansson.xyz / / / / / / / / / / / / / ECG/Bioimpedance Holter / Rev C
bPlace: 1 | ERA | 2 | RRA | 3 | ELA | 4 | RLA | 5 | REF | 6 | AN | 7 | CAT | 8 | GND | AN | CAT | VCC